# Altium schematic sheet PWR_M_V1.SchDoc
size A4
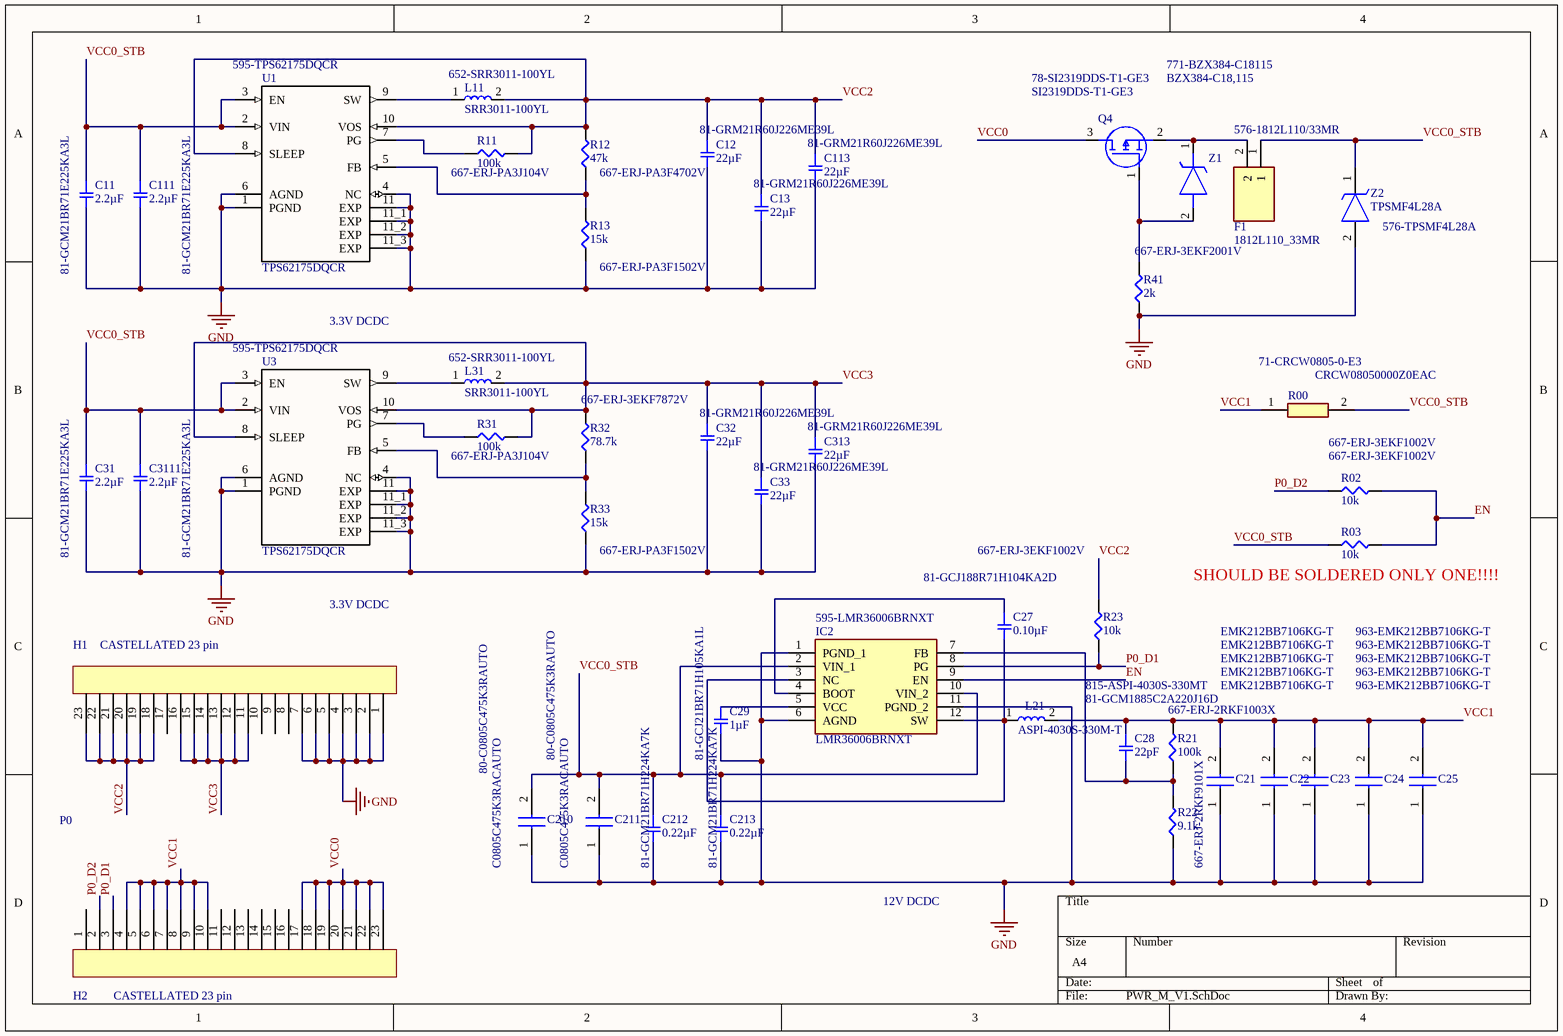
[diagram p0: PWR_M_V1.SchDoc]

## Parts
C11  2.2µF  Supplier Part Number 1: 81-GCM21BR71E225KA3L  [SMD-0805C]
C12  22µF  Supplier Part Number 1: 81-GRM21R60J226ME39L  [SMD-0805C]
C13  22µF  Supplier Part Number 1: 81-GRM21R60J226ME39L  [SMD-0805C]
C21  EMK212BB7106KG-T  Supplier Part Number 1: 963-EMK212BB7106KG-T  [CAPC2012X135N]
C22  EMK212BB7106KG-T  Supplier Part Number 1: 963-EMK212BB7106KG-T  [CAPC2012X135N]
C23  EMK212BB7106KG-T  Supplier Part Number 1: 963-EMK212BB7106KG-T  [CAPC2012X135N]
C24  EMK212BB7106KG-T  Supplier Part Number 1: 963-EMK212BB7106KG-T  [CAPC2012X135N]
C25  EMK212BB7106KG-T  Supplier Part Number 1: 963-EMK212BB7106KG-T  [CAPC2012X135N]
C27  0.10µF  Supplier Part Number 1: 81-GCJ188R71H104KA2D  [SMD-0603C]
C28  22pF  Supplier Part Number 1: 81-GCM1885C2A220J16D  [SMD-0603C]
C29  1µF  Supplier Part Number 1: 81-GCJ21BR71H105KA1L  [SMD-0805C]
C31  2.2µF  Supplier Part Number 1: 81-GCM21BR71E225KA3L  [SMD-0805C]
C32  22µF  Supplier Part Number 1: 81-GRM21R60J226ME39L  [SMD-0805C]
C33  22µF  Supplier Part Number 1: 81-GRM21R60J226ME39L  [SMD-0805C]
C111  2.2µF  Supplier Part Number 1: 81-GCM21BR71E225KA3L  [SMD-0805C]
C113  22µF  Supplier Part Number 1: 81-GRM21R60J226ME39L  [SMD-0805C]
C210  C0805C475K3RACAUTO  Supplier Part Number 1: 80-C0805C475K3RAUTO  [CAPC2012X125N]
C211  C0805C475K3RACAUTO  Supplier Part Number 1: 80-C0805C475K3RAUTO  [CAPC2012X125N]
C212  0.22µF  Supplier Part Number 1: 81-GCM21BR71H224KA7K  [SMD-0805C]
C213  0.22µF  Supplier Part Number 1: 81-GCM21BR71H224KA7K  [SMD-0805C]
C313  22µF  Supplier Part Number 1: 81-GRM21R60J226ME39L  [SMD-0805C]
C3111  2.2µF  Supplier Part Number 1: 81-GCM21BR71E225KA3L  [SMD-0805C]
F1  1812L110_33MR  Supplier Part Number 1: 576-1812L110/33MR  [FUSC4632X200N]
H1  CASTELLATED 23 pin  [CASTELLATED 23 pin]
H2  CASTELLATED 23 pin  [CASTELLATED 23 pin]
IC2  LMR36006BRNXT  Supplier Part Number 1: 595-LMR36006BRNXT  [LMR36015FSCQRNXTQ1]
L11  SRR3011-100YL  Supplier Part Number 1: 652-SRR3011-100YL  [SRR3011-100YL]
L21  ASPI-4030S-330M-T  Supplier Part Number 1: 815-ASPI-4030S-330MT  [INDPM4040X300N]
L31  SRR3011-100YL  Supplier Part Number 1: 652-SRR3011-100YL  [SRR3011-100YL]
Q4  SI2319DDS-T1-GE3  Supplier Part Number 1: 78-SI2319DDS-T1-GE3  [SOT96P240X120-3N]
R00  CRCW08050000Z0EAC  Supplier Part Number 1: 71-CRCW0805-0-E3  [RESC2012X60N]
R02  10k  Supplier Part Number 1: 667-ERJ-3EKF1002V  [SMD-0603-RES]
R03  10k  Supplier Part Number 1: 667-ERJ-3EKF1002V  [SMD-0603-RES]
R11  100k  Supplier Part Number 1: 667-ERJ-PA3J104V  [SMD-0603-RES]
R12  47k  Supplier Part Number 1: 667-ERJ-PA3F4702V  [SMD-0603-RES]
R13  15k  Supplier Part Number 1: 667-ERJ-PA3F1502V  [SMD-0603-RES]
R21  100k  Supplier Part Number 1: 667-ERJ-2RKF1003X  [SMD-0402-RES]
R22  9.1k  Supplier Part Number 1: 667-ERJ-2RKF9101X  [SMD-0402-RES]
R23  10k  Supplier Part Number 1: 667-ERJ-3EKF1002V  [SMD-0603-RES]
R31  100k  Supplier Part Number 1: 667-ERJ-PA3J104V  [SMD-0603-RES]
R32  78.7k  Supplier Part Number 1: 667-ERJ-3EKF7872V  [SMD-0603-RES]
R33  15k  Supplier Part Number 1: 667-ERJ-PA3F1502V  [SMD-0603-RES]
R41  2k  Supplier Part Number 1: 667-ERJ-3EKF2001V  [SMD-0603-RES]
U1  TPS62175DQCR  Supplier Part Number 1: 595-TPS62175DQCR  [*SON50P300X200X80-11N240X84_TPS62175DQCR(Primary)]
U3  TPS62175DQCR  Supplier Part Number 1: 595-TPS62175DQCR  [*SON50P300X200X80-11N240X84_TPS62175DQCR(Primary)]
Z1  BZX384-C18,115  Supplier Part Number 1: 771-BZX384-C18115  [SOD2512X110N]
Z2  TPSMF4L28A  Supplier Part Number 1: 576-TPSMF4L28A  [SODFL3718X108N]

## Nets
GND: C11.2 C12.2 C13.2 C21.1 C22.1 C23.1 C24.1 C25.1 C29.2 C31.2 C32.2 C33.2 C111.2 C113.2 C210.1 C211.1 C212.2 C213.2 C313.2 C3111.2 H1.1 H1.2 H1.3 H1.4 H1.5 H1.6 H1.7 IC2.1(PGND_1) IC2.6(AGND) IC2.11(PGND_2) R13.1 R22.1 R33.1 R41.1 U1.1(PGND) U1.4(NC) U1.6(AGND) U1.11(EXP) U1.11_1(EXP) U1.11_2(EXP) U1.11_3(EXP) U3.1(PGND) U3.4(NC) U3.6(AGND) U3.11(EXP) U3.11_1(EXP) U3.11_2(EXP) U3.11_3(EXP) Z2.2(A)
EN: IC2.9(EN) R02.2 R03.2
P0_D1: H2.3 IC2.8(PG) R23.1
P0_D2: H2.2 R02.1
VCC0: H2.17 H2.18 H2.19 H2.20 H2.21 H2.22 H2.23 Q4.3(D)
VCC0_STB: C11.1 C31.1 C111.1 C210.2 C211.2 C212.1 C213.1 C3111.1 F1.1 IC2.2(VIN_1) IC2.10(VIN_2) R00.2 R03.1 U1.2(VIN) U1.3(EN) U3.2(VIN) U3.3(EN) Z2.1(K)
VCC1: C21.2 C22.2 C23.2 C24.2 C25.2 C28.1 H2.4 H2.5 H2.6 H2.7 H2.8 H2.9 H2.10 L21.2 R00.1 R21.2
VCC2: C12.1 C13.1 C113.1 H1.18 H1.19 H1.20 H1.21 H1.22 H1.23 L11.2 R11.2 R12.2 R23.2 U1.8(SLEEP) U1.10(VOS)
VCC3: C32.1 C33.1 C313.1 H1.11 H1.12 H1.13 H1.14 H1.15 H1.16 L31.2 R31.2 R32.2 U3.8(SLEEP) U3.10(VOS)
NetC27_1: C27.1 IC2.4(BOOT)
NetC27_2: C27.2 IC2.3(NC) IC2.12(SW) L21.1
NetC28_2: C28.2 IC2.7(FB) R21.1 R22.2
NetC29_1: C29.1 IC2.5(VCC)
NetF1_2: F1.2 Q4.2(S) Z1.1(K)
NetL11_1: L11.1 U1.9(SW)
NetL31_1: L31.1 U3.9(SW)
NetQ4_1: Q4.1(G) R41.2 Z1.2(A)
NetR11_1: R11.1 U1.7(PG)
NetR12_1: R12.1 R13.2 U1.5(FB)
NetR31_1: R31.1 U3.7(PG)
NetR32_1: R32.1 R33.2 U3.5(FB)

Not connected (* = marked no-connect by the designer): H1 8 9 10 17; H2 1 11 12 13 14 15 16

## Notes on the sheet
- 3.3V DCDC
- (near R03) SHOULD BE SOLDERED ONLY ONE!!!!
- P0
- 12V DCDC

## Library data of the parts
C11 C31 C111 C3111 = GCM21BR71E225KA73L: CAP CER 2.2UF 25V X7R 0805; Manufacturer: Murata Electronics North America; Factory Stock: 0; Unit Price (USD): 0.35; Minimum Quantity: 1; Tolerance: ±10%; Datasheets: http://www.murata.com/~/media/webrenewal/support/library/catalog/products/capacitor/mlcc/c03e.ashx; Image: //media.digikey.com/photos/Murata%20Photos/NCP,GCM%20SERIES%200805.jpg; Digi-Key Part Number: 490-4787-1-ND; Part Number: GCM21BR71E225KA73L; Quantity Available: 18461; @ qty: 0; Packaging: Cut Tape (CT); Series: GCM; Part Status: Active; Value: 2.2µF; Voltage: 25V; Temperature Coefficient: X7R; Operating Temperature: -55°C ~ 125°C; Features: -; Ratings: AEC-Q200; Applications: Automotive; Mounting Type: Surface Mount, MLCC; Package / Case: 0805 (2012 Metric); Size / Dimension: 0.079" L x 0.049" W (2.00mm x 1.25mm); Height - Seated (Max): -; Thickness (Max): 0.055" (1.40mm); Lead Spacing: -; Lead Style: -; Supplier 1: Mouser
C12 C13 C32 C33 C113 C313 = GRM21BR60J226ME39L: CAP CER 22UF 6.3V X5R 0805; Manufacturer: Murata Electronics North America; Factory Stock: 0; Unit Price (USD): 0,24; Minimum Quantity: 1; Tolerance: ±20%; Part Number: GRM21BR60J226ME39L; Datasheets: http://www.murata.com/~/media/webrenewal/support/library/catalog/products/capacitor/mlcc/c02e.pdf; Image: //media.digikey.com/Renders/Murata%20Renders/0805%20(2012%20Metric)%20.85mm.jpg; Digi-Key Part Number: 490-1719-1-ND; Quantity Available: 983766; @ qty: 0; Packaging: Cut Tape (CT); Series: GRM; Part Status: Active; Value: 22µF; Voltage: 6.3V; Temperature Coefficient: X5R; Operating Temperature: -55°C ~ 85°C; Features: -; Ratings: -; Applications: General Purpose; Mounting Type: Surface Mount, MLCC; Package / Case: 0805 (2012 Metric); Size / Dimension: 0.079" L x 0.049" W (2.00mm x 1.25mm); Height - Seated (Max): -; Thickness (Max): 0.053" (1.35mm); Lead Spacing: -; Lead Style: -; Supplier 1: Mouser
C21-C25 = EMK212BB7106KG-T: Capacitor; Manufacturer_Name: TAIYO YUDEN; Height: 1.35mm; Manufacturer_Part_Number: EMK212BB7106KG-T; Supplier 1: Mouser
C27 = GCJ188R71H104KA12D: CAP CER 0.1UF 50V X7R 0603; Manufacturer: Murata Electronics North America; Factory Stock: 0; Unit Price (USD): 0.12; Minimum Quantity: 1; Tolerance: ±10%; Datasheets: http://www.murata.com/~/media/webrenewal/support/library/catalog/products/capacitor/mlcc/c03e.ashx; Image: //media.digikey.com/Renders/Murata%20Renders/0603%28LQG18%29.jpg; Digi-Key Part Number: 490-5798-1-ND; Part Number: GCJ188R71H104KA12D; Quantity Available: 163695; @ qty: 0; Packaging: Cut Tape (CT); Series: GCJ; Part Status: Active; Value: 0.10µF; Voltage: 50V; Temperature Coefficient: X7R; Operating Temperature: -55°C ~ 125°C; Features: Soft Termination; Ratings: AEC-Q200; Applications: Automotive, Boardflex Sensitive; Mounting Type: Surface Mount, MLCC; Package / Case: 0603 (1608 Metric); Size / Dimension: 0.063" L x 0.031" W (1.60mm x 0.80mm); Height - Seated (Max): -; Thickness (Max): 0.035" (0.90mm); Lead Spacing: -; Lead Style: -; Supplier 1: Mouser
C28 = GCM1885C2A220JA16D: CAP CER 22PF 100V NP0 0603; Manufacturer: Murata Electronics North America; Factory Stock: 0; Unit Price (USD): 0.11; Minimum Quantity: 1; Tolerance: ±5%; Temperature Coefficient: C0G, NP0; Datasheets: http://www.murata.com/~/media/webrenewal/support/library/catalog/products/capacitor/mlcc/c03e.ashx; Image: //media.digikey.com/Renders/Murata%20Renders/0603%28GCM188%29.jpg; Digi-Key Part Number: 490-4942-1-ND; Part Number: GCM1885C2A220JA16D; Quantity Available: 39916; @ qty: 0; Packaging: Cut Tape (CT); Series: GCM; Part Status: Active; Value: 22pF; Voltage: 100V; Operating Temperature: -55°C ~ 125°C; Features: -; Ratings: AEC-Q200; Applications: Automotive; Mounting Type: Surface Mount, MLCC; Package / Case: 0603 (1608 Metric); Size / Dimension: 0.063" L x 0.031" W (1.60mm x 0.80mm); Height - Seated (Max): -; Thickness (Max): 0.035" (0.90mm); Lead Spacing: -; Lead Style: -; Supplier 1: Mouser
C29 = GCJ21BR71H105KA01L: CAP CER 1UF 50V X7R 0805; Manufacturer: Murata Electronics North America; Factory Stock: 0; Unit Price (USD): 0.33; Minimum Quantity: 1; Tolerance: ±10%; Datasheets: http://www.murata.com/~/media/webrenewal/support/library/catalog/products/capacitor/mlcc/c03e.ashx; Image: //media.digikey.com/Renders/Murata%20Renders/0805%20(2012%20Metric)%20.85mm.jpg; Digi-Key Part Number: 490-10667-1-ND; Part Number: GCJ21BR71H105KA01L; Quantity Available: 55137; @ qty: 0; Packaging: Cut Tape (CT); Series: GCJ; Part Status: Active; Value: 1µF; Voltage: 50V; Temperature Coefficient: X7R; Operating Temperature: -55°C ~ 125°C; Features: Soft Termination; Ratings: AEC-Q200; Applications: Automotive, Boardflex Sensitive; Mounting Type: Surface Mount, MLCC; Package / Case: 0805 (2012 Metric); Size / Dimension: 0.079" L x 0.049" W (2.00mm x 1.25mm); Height - Seated (Max): -; Thickness (Max): 0.057" (1.45mm); Lead Spacing: -; Lead Style: -; Supplier 1: Mouser
C210 C211 = C0805C475K3RACAUTO: Capacitor; Manufacturer_Name: Kemet; Datasheet Link: https://componentsearchengine.com/Datasheets/1/C0805C475K3RACAUTO.pdf; Height: 1.25mm; Mouser2 Part Number: 80-C0805C475K3RAUTO; Mouser2 Price/Stock: https://www.mouser.com/Search/Refine.aspx?Keyword=80-C0805C475K3RAUTO; Manufacturer_Part_Number: C0805C475K3RACAUTO; Supplier 1: Mouser
C212 C213 = GCM21BR71H224KA37K: CAP CER 0.22UF 50V X7R 0805; Manufacturer: Murata Electronics North America; Factory Stock: 0; Unit Price (USD): 0.24; Minimum Quantity: 1; Tolerance: ±10%; Datasheets: http://www.murata.com/~/media/webrenewal/support/library/catalog/products/capacitor/mlcc/c03e.ashx; Image: //media.digikey.com/photos/Murata%20Photos/NCP,GCM%20SERIES%200805.jpg; Digi-Key Part Number: 490-13311-1-ND; Part Number: GCM21BR71H224KA37K; Quantity Available: 9007; @ qty: 0; Packaging: Cut Tape (CT); Series: GCM; Part Status: Active; Value: 0.22µF; Voltage: 50V; Temperature Coefficient: X7R; Operating Temperature: -55°C ~ 125°C; Features: -; Ratings: AEC-Q200; Applications: Automotive; Mounting Type: Surface Mount, MLCC; Package / Case: 0805 (2012 Metric); Size / Dimension: 0.079" L x 0.049" W (2.00mm x 1.25mm); Height - Seated (Max): -; Thickness (Max): 0.055" (1.40mm); Lead Spacing: -; Lead Style: -; Supplier 1: Mouser
F1 = 1812L110_33MR: Fuse; Manufacturer_Name: LITTELFUSE; Manufacturer_Part_Number: 1812L110/33MR; Datasheet Link: https://componentsearchengine.com/Datasheets/1/1812L110_33MR.pdf; Height: 2mm; Mouser2 Part Number: 576-1812L110/33MR; Mouser2 Price/Stock: https://www.mouser.com/Search/Refine.aspx?Keyword=576-1812L110%2F33MR; Supplier 1: Mouser
IC2 = LMR36006BRNXT: Integrated Circuit; Manufacturer_Name: Texas Instruments; Datasheet Link: http://www.ti.com/lit/gpn/LMR36006; Height: 0.9mm; Mouser2 Part Number: 595-LMR36006BRNXT; Mouser2 Price/Stock: https://www.mouser.com/Search/Refine.aspx?Keyword=595-LMR36006BRNXT; Manufacturer_Part_Number: LMR36006BRNXT; Supplier 1: Mouser
Q4 = SI2319DDS-T1-GE3: MOSFET (P-Channel); Manufacturer_Name: Vishay; Datasheet Link: https://www.vishay.com/docs/79400/si2319dds.pdf; Height: 1.2mm; Manufacturer_Part_Number: SI2319DDS-T1-GE3; Supplier 1: Mouser
R00 = CRCW08050000Z0EAC: Resistor; Manufacturer_Name: Vishay; Datasheet Link: https://componentsearchengine.com/Datasheets/1/CRCW08050000Z0EAC.pdf; Height: 0.6mm; Mouser2 Part Number: 71-CRCW08050000Z0EAC; Mouser2 Price/Stock: https://www.mouser.com/Search/Refine.aspx?Keyword=71-CRCW08050000Z0EAC; Manufacturer_Part_Number: CRCW08050000Z0EAC; Supplier 1: Mouser
R02 R03 R23 = ERJ-3EKF1002V: RES SMD 10K OHM 1% 1/10W 0603; Manufacturer: Panasonic Electronic Components; Factory Stock: 0; Unit Price (USD): 0.00379; @ qty: 1500; Minimum Quantity: 1; Power (Watts): 0.1W, 1/10W; Temperature Coefficient: ±100ppm/°C; Part Number: ERJ-3EKF1002V; Datasheets: http://industrial.panasonic.com/www-cgi/jvcr13pz.cgi?E+PZ+3+AOA0002+ERJ3EKF1002V+7+WW; Image: //media.digikey.com/Photos/Panasonic%20Photos/MFG_ERJ-P6W%20Series.jpg; Digi-Key Part Number: P10.0KHCT-ND; Quantity Available: 6703141; Packaging: Cut Tape (CT); Series: ERJ; Part Status: Active; Value: 10k; Tolerance: ±1%; Composition: Thick Film; Features: Automotive AEC-Q200; Operating Temperature: -55°C ~ 155°C; Package / Case: 0603 (1608 Metric); Supplier Device Package: 0603; Size / Dimension: 0.063" L x 0.031" W (1.60mm x 0.80mm); Height - Seated (Max): 0.022" (0.55mm); Number of Terminations: 2; Failure Rate: -; Supplier 1: Mouser
R11 R31 = ERJ-PA3J104V: RES SMD 100K OHM 5% 1/4W 0603; Manufacturer: Panasonic Electronic Components; Factory Stock: 0; Unit Price (USD): 0.01646; @ qty: 1500; Minimum Quantity: 1; Power (Watts): 0.25W, 1/4W; Temperature Coefficient: ±200ppm/°C; Part Number: ERJ-PA3J104V; Datasheets: https://industrial.panasonic.com/cdbs/www-data/pdf/RDA0000/AOA0000C243.pdf; Image: //media.digikey.com/Photos/Panasonic%20Photos/MFG_ERJ-P6W%20Series.jpg; Digi-Key Part Number: P100KBZCT-ND; Quantity Available: 4793; Packaging: Cut Tape (CT); Series: ERJ; Part Status: Active; Value: 100k; Tolerance: ±5%; Composition: Thick Film; Features: Automotive AEC-Q200, Pulse Withstanding; Operating Temperature: -55°C ~ 155°C; Package / Case: 0603 (1608 Metric); Supplier Device Package: 0603; Size / Dimension: 0.063" L x 0.031" W (1.60mm x 0.80mm); Height - Seated (Max): 0.022" (0.55mm); Number of Terminations: 2; Failure Rate: -; Supplier 1: Mouser
R12 = ERJ-PA3F4702V: RES SMD 47K OHM 1% 1/4W 0603; Manufacturer: Panasonic Electronic Components; Factory Stock: 0; Unit Price (USD): 0.02372; @ qty: 1500; Minimum Quantity: 1; Power (Watts): 0.25W, 1/4W; Temperature Coefficient: ±100ppm/°C; Part Number: ERJ-PA3F4702V; Datasheets: https://industrial.panasonic.com/cdbs/www-data/pdf/RDA0000/AOA0000C243.pdf; Image: //media.digikey.com/Photos/Panasonic%20Photos/MFG_ERJ-P6W%20Series.jpg; Digi-Key Part Number: P47KBYCT-ND; Quantity Available: 7124; Packaging: Cut Tape (CT); Series: ERJ; Part Status: Active; Value: 47k; Tolerance: ±1%; Composition: Thick Film; Features: Automotive AEC-Q200, Pulse Withstanding; Operating Temperature: -55°C ~ 155°C; Package / Case: 0603 (1608 Metric); Supplier Device Package: 0603; Size / Dimension: 0.063" L x 0.031" W (1.60mm x 0.80mm); Height - Seated (Max): 0.022" (0.55mm); Number of Terminations: 2; Failure Rate: -; Supplier 1: Mouser
R13 R33 = ERJ-PA3F1502V: RES SMD 15K OHM 1% 1/4W 0603; Manufacturer: Panasonic Electronic Components; Factory Stock: 0; Unit Price (USD): 0.02372; @ qty: 1500; Minimum Quantity: 1; Power (Watts): 0.25W, 1/4W; Temperature Coefficient: ±100ppm/°C; Part Number: ERJ-PA3F1502V; Datasheets: https://industrial.panasonic.com/cdbs/www-data/pdf/RDA0000/AOA0000C243.pdf; Image: //media.digikey.com/Photos/Panasonic%20Photos/MFG_ERJ-P6W%20Series.jpg; Digi-Key Part Number: P15KBYCT-ND; Quantity Available: 8940; Packaging: Cut Tape (CT); Series: ERJ; Part Status: Active; Value: 15k; Tolerance: ±1%; Composition: Thick Film; Features: Automotive AEC-Q200, Pulse Withstanding; Operating Temperature: -55°C ~ 155°C; Package / Case: 0603 (1608 Metric); Supplier Device Package: 0603; Size / Dimension: 0.063" L x 0.031" W (1.60mm x 0.80mm); Height - Seated (Max): 0.022" (0.55mm); Number of Terminations: 2; Failure Rate: -; Supplier 1: Mouser
R21 = ERJ-2RKF1003X: RES SMD 100K OHM 1% 1/10W 0402; Manufacturer: Panasonic Electronic Components; Factory Stock: 0; Unit Price (USD): 0.00496; @ qty: 1500; Minimum Quantity: 1; Power (Watts): 0.1W, 1/10W; Temperature Coefficient: ±100ppm/°C; Part Number: ERJ-2RKF1003X; Datasheets: http://industrial.panasonic.com/www-cgi/jvcr13pz.cgi?E+PZ+3+AOA0002+ERJ2RKF1003X+7+WW; Image: //media.digikey.com/Photos/Panasonic%20Photos/ERJ-PA2-Series.jpg; Digi-Key Part Number: P100KLCT-ND; Quantity Available: 2645965; Packaging: Cut Tape (CT); Series: ERJ; Part Status: Active; Value: 100k; Tolerance: ±1%; Composition: Thick Film; Features: Automotive AEC-Q200; Operating Temperature: -55°C ~ 155°C; Package / Case: 0402 (1005 Metric); Supplier Device Package: 0402; Size / Dimension: 0.039" L x 0.020" W (1.00mm x 0.50mm); Height - Seated (Max): 0.016" (0.40mm); Number of Terminations: 2; Failure Rate: -; Supplier 1: Mouser
R22 = ERJ-2RKF9101X: RES SMD 9.1K OHM 1% 1/10W 0402; Manufacturer: Panasonic Electronic Components; Factory Stock: 0; Unit Price (USD): 0.00496; @ qty: 1500; Minimum Quantity: 1; Power (Watts): 0.1W, 1/10W; Temperature Coefficient: ±100ppm/°C; Part Number: ERJ-2RKF9101X; Datasheets: http://industrial.panasonic.com/www-cgi/jvcr13pz.cgi?E+PZ+3+AOA0002+ERJ2RKF9101X+7+WW; Image: //media.digikey.com/Photos/Panasonic%20Photos/ERJ-PA2-Series.jpg; Digi-Key Part Number: P9.10KLCT-ND; Quantity Available: 92711; Packaging: Cut Tape (CT); Series: ERJ; Part Status: Active; Value: 9.1k; Tolerance: ±1%; Composition: Thick Film; Features: Automotive AEC-Q200; Operating Temperature: -55°C ~ 155°C; Package / Case: 0402 (1005 Metric); Supplier Device Package: 0402; Size / Dimension: 0.039" L x 0.020" W (1.00mm x 0.50mm); Height - Seated (Max): 0.016" (0.40mm); Number of Terminations: 2; Failure Rate: -; Supplier 1: Mouser
R32 = ERJ-3EKF7872V: RES SMD 78.7K OHM 1% 1/10W 0603; Manufacturer: Panasonic Electronic Components; Factory Stock: 0; Unit Price (USD): 0.00379; @ qty: 1500; Minimum Quantity: 1; Power (Watts): 0.1W, 1/10W; Temperature Coefficient: ±100ppm/°C; Part Number: ERJ-3EKF7872V; Datasheets: http://industrial.panasonic.com/www-cgi/jvcr13pz.cgi?E+PZ+3+AOA0002+ERJ3EKF7872V+7+WW; Image: //media.digikey.com/Photos/Panasonic%20Photos/MFG_ERJ-P6W%20Series.jpg; Digi-Key Part Number: P78.7KHCT-ND; Quantity Available: 129417; Packaging: Cut Tape (CT); Series: ERJ; Part Status: Active; Value: 78.7k; Tolerance: ±1%; Composition: Thick Film; Features: Automotive AEC-Q200; Operating Temperature: -55°C ~ 155°C; Package / Case: 0603 (1608 Metric); Supplier Device Package: 0603; Size / Dimension: 0.063" L x 0.031" W (1.60mm x 0.80mm); Height - Seated (Max): 0.022" (0.55mm); Number of Terminations: 2; Failure Rate: -; Supplier 1: Mouser
R41 = ERJ-3EKF2001V: RES SMD 2K OHM 1% 1/10W 0603; Manufacturer: Panasonic Electronic Components; Factory Stock: 0; Unit Price (USD): 0.00379; @ qty: 1500; Minimum Quantity: 1; Power (Watts): 0.1W, 1/10W; Temperature Coefficient: ±100ppm/°C; Part Number: ERJ-3EKF2001V; Datasheets: http://industrial.panasonic.com/www-cgi/jvcr13pz.cgi?E+PZ+3+AOA0002+ERJ3EKF2001V+7+WW; Image: //media.digikey.com/Photos/Panasonic%20Photos/MFG_ERJ-P6W%20Series.jpg; Digi-Key Part Number: P2.00KHCT-ND; Quantity Available: 1021544; Packaging: Cut Tape (CT); Series: ERJ; Part Status: Active; Value: 2k; Tolerance: ±1%; Composition: Thick Film; Features: Automotive AEC-Q200; Operating Temperature: -55°C ~ 155°C; Package / Case: 0603 (1608 Metric); Supplier Device Package: 0603; Size / Dimension: 0.063" L x 0.031" W (1.60mm x 0.80mm); Height - Seated (Max): 0.022" (0.55mm); Number of Terminations: 2; Failure Rate: -; Supplier 1: Mouser
U1 U3 = TPS62175DQCR: 28V, 0.5A Step-Down Converter with SNOOZE Mode 10-WSON -40 to 85; MF: Texas Instruments; Package: WSON-10 Texas Instruments; Price: None; Availability: Unavailable; MP: TPS62175DQCR; SnapEDA_Link: https://www.snapeda.com/parts/TPS62175DQCR/Texas%20Instruments/view-part/?ref=snap; Value: *; Supplier 1: Mouser
Z1 = BZX384-C18,115: Zener Diode; Manufacturer_Name: Nexperia; Datasheet Link: https://componentsearchengine.com/Datasheets/1/BZX384-C18,115.pdf; Height: 1.1mm; Mouser2 Part Number: 771-BZX384-C18115; Mouser2 Price/Stock: https://www.mouser.com/Search/Refine.aspx?Keyword=771-BZX384-C18115; Manufacturer_Part_Number: BZX384-C18,115; Supplier 1: Mouser
Z2 = TPSMF4L28A: TVS Diode (Uni-directional); Manufacturer_Name: LITTELFUSE; Datasheet Link: http://www.littelfuse.com/~/media/electronics/datasheets/tvs_diodes/littelfuse_tvs_diode_tpsmf4l_datasheet.pdf.pdf; Height: 1.08mm; Manufacturer_Part_Number: TPSMF4L28A; Supplier 1: Mouser
L11 L31 = SRR3011-100YL: Supplier 1: Mouser
L21 = ASPI-4030S-330M-T: Supplier 1: Mouser